# Altium schematic sheet tie-il34-sdram.SchDoc: Copper Suicide - Net Tie SDRAM
size Letter; CheckedBy: J. Brinton; CompanyName: Signal Laboratories, Inc.; DrawnBy: J. Brinton; Engineer: J. Brinton; Address1: 3479 Edison Way; Address2: Menlo Park CA 94025; Address3: +1 (877) 778-8435; Address4: siglabs.com; Revision: 3; SheetNumber: 19; SheetTotal: 47
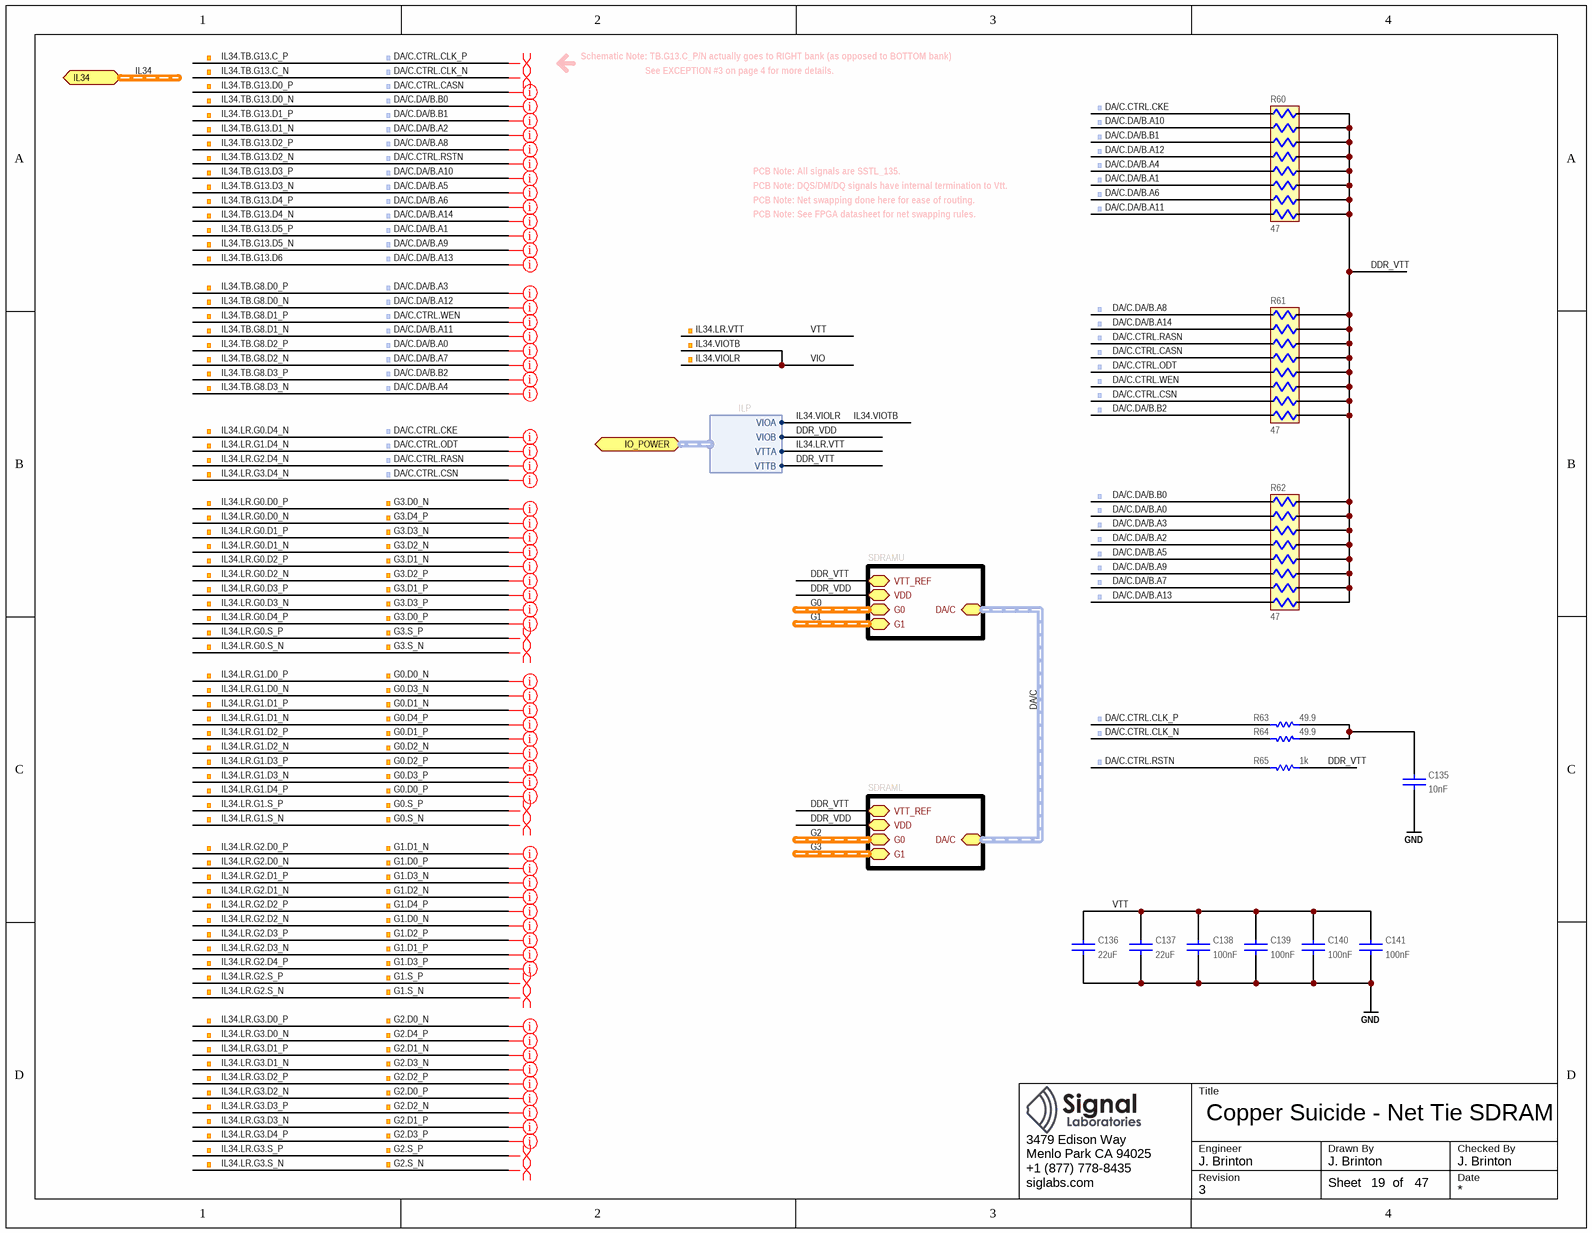
[diagram p0: tie-il34-sdram.SchDoc]

## Parts
C135  value 10nF  [CAPC100X50X55L25N]  (hidden comment: GRM155R71H103KA88)
C136  value 22uF  [CAPC200X125X145L45N]  (hidden comment: C2012X7S1A226M125)
C137  value 22uF  [CAPC200X125X145L45N]  (hidden comment: C2012X7S1A226M125)
C138  value 100nF  [CAPC100X50X55L25N]  (hidden comment: GCM155R71H104KE02)
C139  value 100nF  [CAPC100X50X55L25N]  (hidden comment: GCM155R71H104KE02)
C140  value 100nF  [CAPC100X50X55L25N]  (hidden comment: GCM155R71H104KE02)
C141  value 100nF  [CAPC100X50X55L25N]  (hidden comment: GCM155R71H104KE02)
R60  value 47  [RESCAXE16P50_380X160X55L30X35N]  (hidden comment: EXB-2HV470JV)
R61  value 47  [RESCAXE16P50_380X160X55L30X35N]  (hidden comment: EXB-2HV470JV)
R62  value 47  [RESCAXE16P50_380X160X55L30X35N]  (hidden comment: EXB-2HV470JV)
R63  value 49.9  [RESC1005X40N]  (hidden comment: ERJ-2RKF49R9X)
R64  value 49.9  [RESC1005X40N]  (hidden comment: ERJ-2RKF49R9X)
R65  value 1k  [RESC1005X40N]  (hidden comment: ERJ-2RKF1001X)

## Sub-sheets
SDRAML = sdram.SchDoc: G0 (harness DQS), DA/C (harness DA/C-1V35), G1 (harness DQS), VTT_REF, VDD
SDRAMU = sdram.SchDoc: G0 (harness DQS), DA/C (harness DA/C-1V35), G1 (harness DQS), VTT_REF, VDD

## Ports
IL34 (harness IL), IO_POWER (harness ILP)

## Harnesses
ILP: VIOA, VIOB, VTTA, VTTB

## Nets
GND: C135.1 C136.2 C137.2 C138.1 C139.1 C140.1 C141.1
DA/C.CTRL.CASN: R61.4  [also labelled IL34.TB.G13.D0_P]
DA/C.CTRL.CKE: R60.1  [also labelled IL34.LR.G0.D4_N]
DA/C.CTRL.CLK_N: R64.2  [also labelled IL34.TB.G13.C_N]
DA/C.CTRL.CLK_P: R63.2  [also labelled IL34.TB.G13.C_P]
DA/C.CTRL.CSN: R61.7  [also labelled IL34.LR.G3.D4_N]
DA/C.CTRL.ODT: R61.5  [also labelled IL34.LR.G1.D4_N]
DA/C.CTRL.RASN: R61.3  [also labelled IL34.LR.G2.D4_N]
DA/C.CTRL.RSTN: R65.1  [also labelled IL34.TB.G13.D2_N]
DA/C.CTRL.WEN: R61.6  [also labelled IL34.TB.G8.D1_P]
DA/C.DA/B.A0: R62.2  [also labelled IL34.TB.G8.D2_P]
DA/C.DA/B.A1: R60.6  [also labelled IL34.TB.G13.D5_P]
DA/C.DA/B.A2: R62.4  [also labelled IL34.TB.G13.D1_N]
DA/C.DA/B.A3: R62.3  [also labelled IL34.TB.G8.D0_P]
DA/C.DA/B.A4: R60.5  [also labelled IL34.TB.G8.D3_N]
DA/C.DA/B.A5: R62.5  [also labelled IL34.TB.G13.D3_N]
DA/C.DA/B.A6: R60.7  [also labelled IL34.TB.G13.D4_P]
DA/C.DA/B.A7: R62.7  [also labelled IL34.TB.G8.D2_N]
DA/C.DA/B.A8: R61.1  [also labelled IL34.TB.G13.D2_P]
DA/C.DA/B.A9: R62.6  [also labelled IL34.TB.G13.D5_N]
DA/C.DA/B.A10: R60.2  [also labelled IL34.TB.G13.D3_P]
DA/C.DA/B.A11: R60.8  [also labelled IL34.TB.G8.D1_N]
DA/C.DA/B.A12: R60.4  [also labelled IL34.TB.G8.D0_N]
DA/C.DA/B.A13: R62.8  [also labelled IL34.TB.G13.D6]
DA/C.DA/B.A14: R61.2  [also labelled IL34.TB.G13.D4_N]
DA/C.DA/B.B0: R62.1  [also labelled IL34.TB.G13.D0_N]
DA/C.DA/B.B1: R60.3  [also labelled IL34.TB.G13.D1_P]
DA/C.DA/B.B2: R61.8  [also labelled IL34.TB.G8.D3_P]
DDR_VDD: sheet SDRAMU/VDD, sheet SDRAML/VDD, port IO_POWER.VIOB
DDR_VTT: R60.9 R60.10 R60.11 R60.12 R60.13 R60.14 R60.15 R60.16 R61.9 R61.10 R61.11 R61.12 R61.13 R61.14 R61.15 R61.16 R62.9 R62.10 R62.11 R62.12 R62.13 R62.14 R62.15 R62.16 R65.2 ; sheet SDRAMU/VTT_REF, sheet SDRAML/VTT_REF, port IO_POWER.VTTB
IL34.LR.VTT: C136.1 C137.1 C138.2 C139.2 C140.2 C141.2 ; port IO_POWER.VTTA  [also labelled VTT]
IL34.VIOLR: port IO_POWER.VIOA  [also labelled IL34.VIOTB, VIO]
NetC135_2: C135.2 R63.1 R64.1

## Buses and harness runs
harness DA/C = sheet SDRAML/DA/C = sheet SDRAMU/DA/C
harness G0 = sheet SDRAMU/G0
harness G1 = sheet SDRAMU/G1
harness G2 = sheet SDRAML/G0
harness G3 = sheet SDRAML/G1
harness IL34 = port IL34

## Layout directives
differential pair; net class ddr_ac; net class z50; net class tight: DA/C.CTRL.CLK_N, DA/C.CTRL.CLK_P
differential pair; net class z50; net class tight; net class ddr_g0: G3.S_N, G3.S_P
net class z50; net class ddr_g0: G3.D0_N, G3.D0_P, G3.D1_N, G3.D1_P, G3.D2_N, G3.D2_P, G3.D3_N, G3.D3_P, G3.D4_P
differential pair; net class z50; net class tight; net class ddr_g1: G0.S_N, G0.S_P
differential pair; net class z50; net class tight; net class ddr_g2: G1.S_N, G1.S_P
differential pair; net class z50; net class tight; net class ddr_g3: G2.S_N, G2.S_P
net class z50; net class ddr_g1: G0.D0_N, G0.D0_P, G0.D1_N, G0.D1_P, G0.D2_N, G0.D2_P, G0.D3_N, G0.D3_P, G0.D4_P
net class z50; net class ddr_g2: G1.D0_N, G1.D0_P, G1.D1_N, G1.D1_P, G1.D2_N, G1.D2_P, G1.D3_N, G1.D3_P, G1.D4_P
net class z50; net class ddr_g3: G2.D0_N, G2.D0_P, G2.D1_N, G2.D1_P, G2.D2_N, G2.D2_P, G2.D3_N, G2.D3_P, G2.D4_P
net class z50; net class ddr_ac: DA/C.CTRL.CASN, DA/C.CTRL.CKE, DA/C.CTRL.CSN, DA/C.CTRL.ODT, DA/C.CTRL.RASN, DA/C.CTRL.RSTN, DA/C.CTRL.WEN, DA/C.DA/B.A0, DA/C.DA/B.A1, DA/C.DA/B.A2, DA/C.DA/B.A3, DA/C.DA/B.A4, DA/C.DA/B.A5, DA/C.DA/B.A6, DA/C.DA/B.A7, DA/C.DA/B.A8, DA/C.DA/B.A9, DA/C.DA/B.A10, DA/C.DA/B.A11, DA/C.DA/B.A12, DA/C.DA/B.A13, DA/C.DA/B.A14, DA/C.DA/B.B0, DA/C.DA/B.B1, DA/C.DA/B.B2

## Notes on the sheet
- Schematic Note: TB.G13.C_P/N actually goes to RIGHT bank (as opposed to BOTTOM bank)
- See EXCEPTION #3 on page 4 for more details.
- PCB Note: All signals are SSTL_135.
- PCB Note: DQS/DM/DQ signals have internal termination to Vtt.
- PCB Note: Net swapping done here for ease of routing.
- PCB Note: See FPGA datasheet for net swapping rules.
- Title
- Engineer
- Revision
- Drawn By
- Checked By
- Date
- Sheet
- of

## Library data of the parts
C135 = CAP: Ceramic Capacitor 10nF ±10% 50V X7R 0402; Manufacturer: Murata; Tr: -55:125; Voltage: 50V; Manufacturer P/N: GRM155R71H103KA88; Tolerance: ±10%; Footprint: *; Package: 0402
C136 C137 = CAP: Ceramic Capacitor 22uF ±20% 10V X7S 0805; Manufacturer: TDK; Tr: -55:125; Tolerance: ±20%; Manufacturer P/N: C2012X7S1A226M125; Voltage: 10V; Footprint: *; Package: 0805
C138-C141 = CAP: Ceramic Capacitor 100nF ±10% 50V X7R 0402; Manufacturer: Murata; Tr: -55:125; Tolerance: ±10%; Manufacturer P/N: GCM155R71H104KE02; Voltage: 50V; Footprint: *; Package: 0402
R60-R62 = EXB-2HV470JV: 8 Resistor Array 47 ±5% 0.0625W 25V 1506; Manufacturer: Panasonic; Tr: -55:125; Manufacturer P/N: EXB-2HV470JV; Package: 1506; Tolerance: ±5%
R63 R64 = RES: Thick Film Resistor 49.9 ±1% 0.1W 50V 0402; Manufacturer: Panasonic; Tcr: ±100; Tr: -55:155; Voltage: 50; Power: 0.1; Tolerance: ±1%; Manufacturer P/N: ERJ-2RKF49R9X; Alternatives: *; Footprint: *; Package: 0402
R65 = RES: Thick Film Resistor 1k ±1% 0.1W 50V 0402; Manufacturer: Panasonic; Tcr: ±100; Tr: -55:155; Voltage: 50; Power: 0.1; Tolerance: ±1%; Manufacturer P/N: ERJ-2RKF1001X; Alternatives: *; Footprint: *; Package: 0402